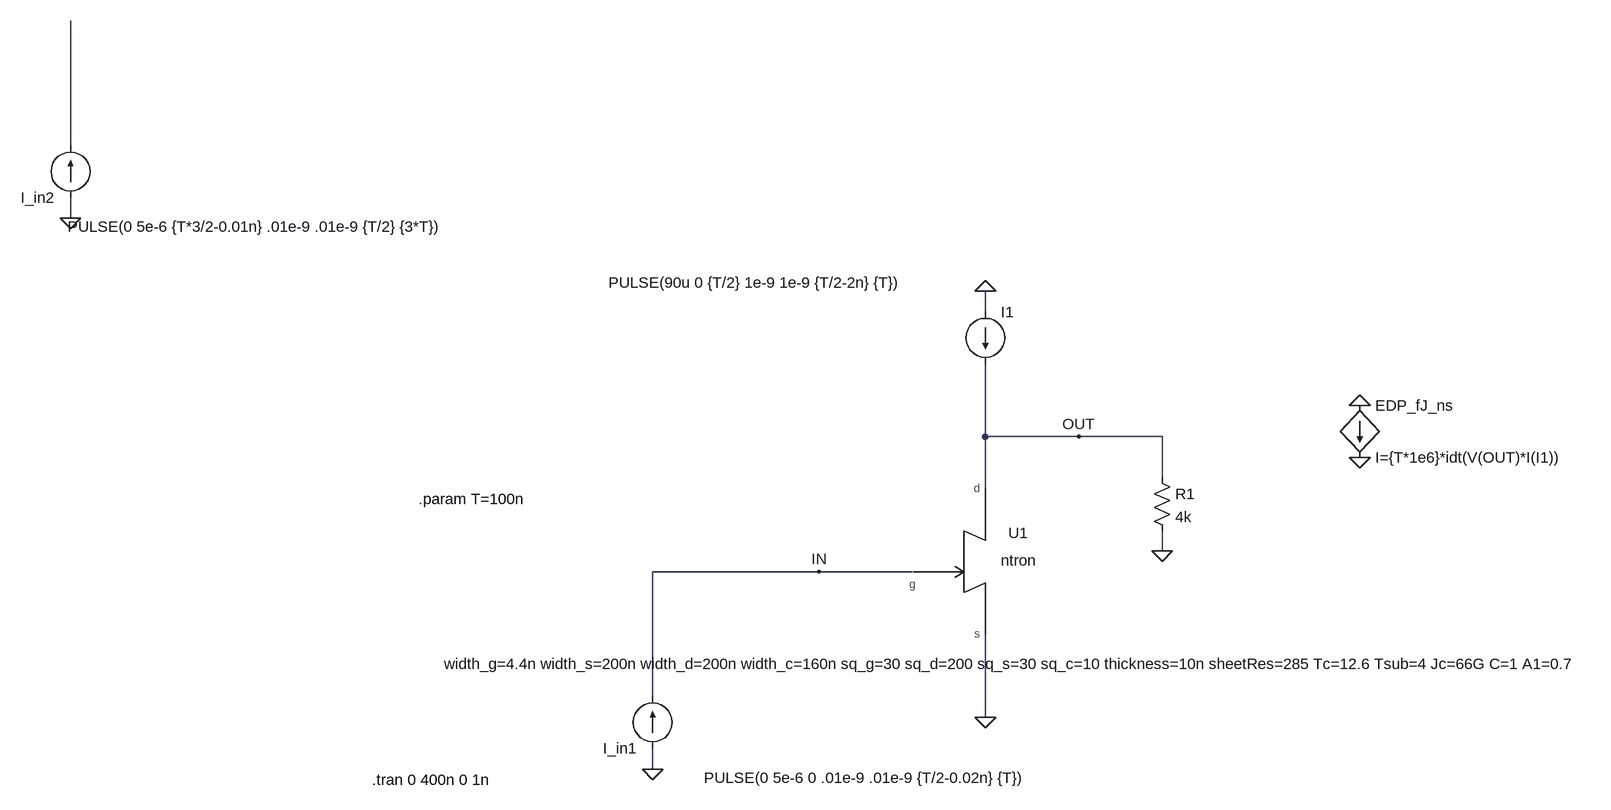
[diagram p0: schematic ntron_EDP_testlatching.asc]
ntron_EDP_testlatching.asc, the LTspice schematic file:
Version 4
SHEET 1 1092 752
WIRE -1344 -368 -1344 -560
WIRE -1344 -256 -1344 -288
WIRE 64 -112 64 -144
WIRE 64 80 64 -32
WIRE 208 80 64 80
WIRE 336 80 208 80
WIRE 336 144 336 80
WIRE 64 160 64 80
WIRE 336 256 336 224
WIRE -192 288 -448 288
WIRE -48 288 -192 288
WIRE -448 480 -448 288
WIRE 64 512 64 384
WIRE -448 592 -448 560
FLAG 64 512 0
FLAG -448 592 0
FLAG 64 -144 0
FLAG 640 112 0
FLAG 640 32 0
FLAG -192 288 IN
FLAG 208 80 OUT
FLAG -1344 -256 0
FLAG 336 256 0
SYMBOL current -448 560 R180
WINDOW 3 -580 -45 Left 2
WINDOW 123 0 0 Left 2
WINDOW 39 0 0 Left 2
SYMATTR Value PULSE(0 5e-6 0 .01e-9 .01e-9 {T/2-0.02n} {T})
SYMATTR InstName I_in1
SYMBOL bi 640 32 R0
SYMATTR InstName EDP_fJ_ns
SYMATTR Value I={T*1e6}*idt(V(OUT)*I(I1))
SYMBOL current -1344 -288 R180
WINDOW 3 -580 -45 Left 2
WINDOW 123 0 0 Left 2
WINDOW 39 0 0 Left 2
SYMATTR Value PULSE(0 5e-6 {T*3/2-0.01n} .01e-9 .01e-9 {T/2} {3*T})
SYMATTR InstName I_in2
SYMBOL ntron 64 272 R0
WINDOW 39 49 142 Top 2
SYMATTR SpiceLine width_g=4.4n width_s=200n width_d=200n width_c=160n sq_g=30 sq_d=200 sq_s=30 sq_c=10 thickness=10n sheetRes=285 Tc=12.6 Tsub=4 Jc=66G C=1 A1=0.7
SYMATTR InstName U1
SYMBOL res 320 128 R0
SYMATTR InstName R1
SYMATTR Value 4k
SYMBOL current 64 -112 R0
WINDOW 3 -580 -45 Left 2
WINDOW 123 0 0 Left 2
WINDOW 39 0 0 Left 2
SYMATTR Value PULSE(90u 0 {T/2} 1e-9 1e-9 {T/2-2n} {T})
SYMATTR InstName I1
TEXT -880 608 Left 2 !.tran 0 400n 0 1n
TEXT -808 176 Left 2 !.param T=100n

The netlist it stands for:
* ntron_EDP_testlatching.asc
I_in1 0 IN PULSE(0 5e-6 0 .01e-9 .01e-9 {T/2-0.02n} {T})
B§EDP_fJ_ns 0 0 I={T*1e6}*idt(V(OUT)*I(I1))
I_in2 0 N001 PULSE(0 5e-6 {T*3/2-0.01n} .01e-9 .01e-9 {T/2} {3*T})
XU1 IN OUT 0 ntron width_g=4.4n width_s=200n width_d=200n width_c=160n sq_g=30 sq_d=200 sq_s=30 sq_c=10 thickness=10n sheetRes=285 Tc=12.6 Tsub=4 Jc=66G C=1 A1=0.7  ; pins g d s
R1 OUT 0 4k
I1 0 OUT PULSE(90u 0 {T/2} 1e-9 1e-9 {T/2-2n} {T})
.tran 0 400n 0 1n
.param T=100n
.lib ntron.lib
.backanno
.end